# Altium schematic sheet Connectors.SchDoc
size A4; SheetNumber: 1; SheetTotal: 2
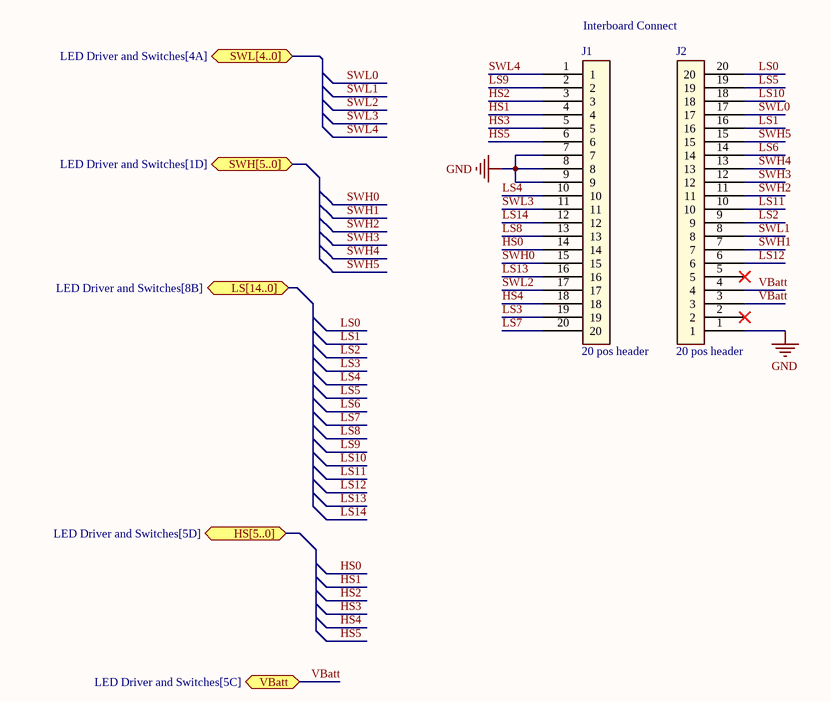
[diagram p0: Connectors.SchDoc]

## Parts
J1  20 pos header  [20 pos header]
J2  20 pos header  [20 pos header]

## Ports
HS[5..0] (bidir, see LED Driver and Switches[5D]), LS[14..0] (bidir, see LED Driver and Switches[8B]), SWH[5..0] (bidir, see LED Driver and Switches[1D]), SWL[4..0] (bidir, see LED Driver and Switches[4A]), VBatt (bidir, see LED Driver and Switches[5C])

## Nets
GND: J1.7 J1.8 J1.9 J2.1
HS0: J1.14
HS1: J1.4
HS2: J1.3
HS3: J1.5
HS4: J1.18
HS5: J1.6
LS0: J2.20
LS1: J2.16
LS2: J2.9
LS3: J1.19
LS4: J1.10
LS5: J2.19
LS6: J2.14
LS7: J1.20
LS8: J1.13
LS9: J1.2
LS10: J2.18
LS11: J2.10
LS12: J2.6
LS13: J1.16
LS14: J1.12
SWH0: J1.15
SWH1: J2.7
SWH2: J2.11
SWH3: J2.12
SWH4: J2.13
SWH5: J2.15
SWL0: J2.17
SWL1: J2.8
SWL2: J1.17
SWL3: J1.11
SWL4: J1.1
VBatt: J2.3 J2.4 ; port VBatt

Not connected (* = marked no-connect by the designer): J2 2* 5*

## Notes on the sheet
- Interboard Connect

## Library data of the parts
J1 J2 = 20 pos header: System: Connector